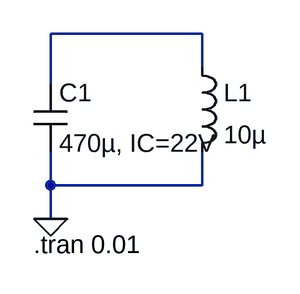
[diagram p0: schematic CAP_discharge.asc]
CAP_discharge.asc, the LTspice schematic file:
Version 4
SHEET 1 880 680
WIRE 192 48 48 48
WIRE 192 80 192 48
WIRE 48 96 48 48
WIRE 48 192 48 160
WIRE 192 192 192 160
WIRE 192 192 48 192
WIRE 48 224 48 192
FLAG 48 224 0
SYMBOL ind 176 64 R0
SYMATTR InstName L1
SYMATTR Value 10µ
SYMBOL cap 32 96 R0
SYMATTR InstName C1
SYMATTR Value 470µ, IC=22V
SYMATTR SpiceLine V=22
TEXT 32 248 Left 2 !.tran 0.01

The netlist it stands for:
* CAP_discharge.asc
L1 N001 0 10µ
C1 N001 0 470µ, IC=22V V=22
.tran 0.01
.backanno
.end